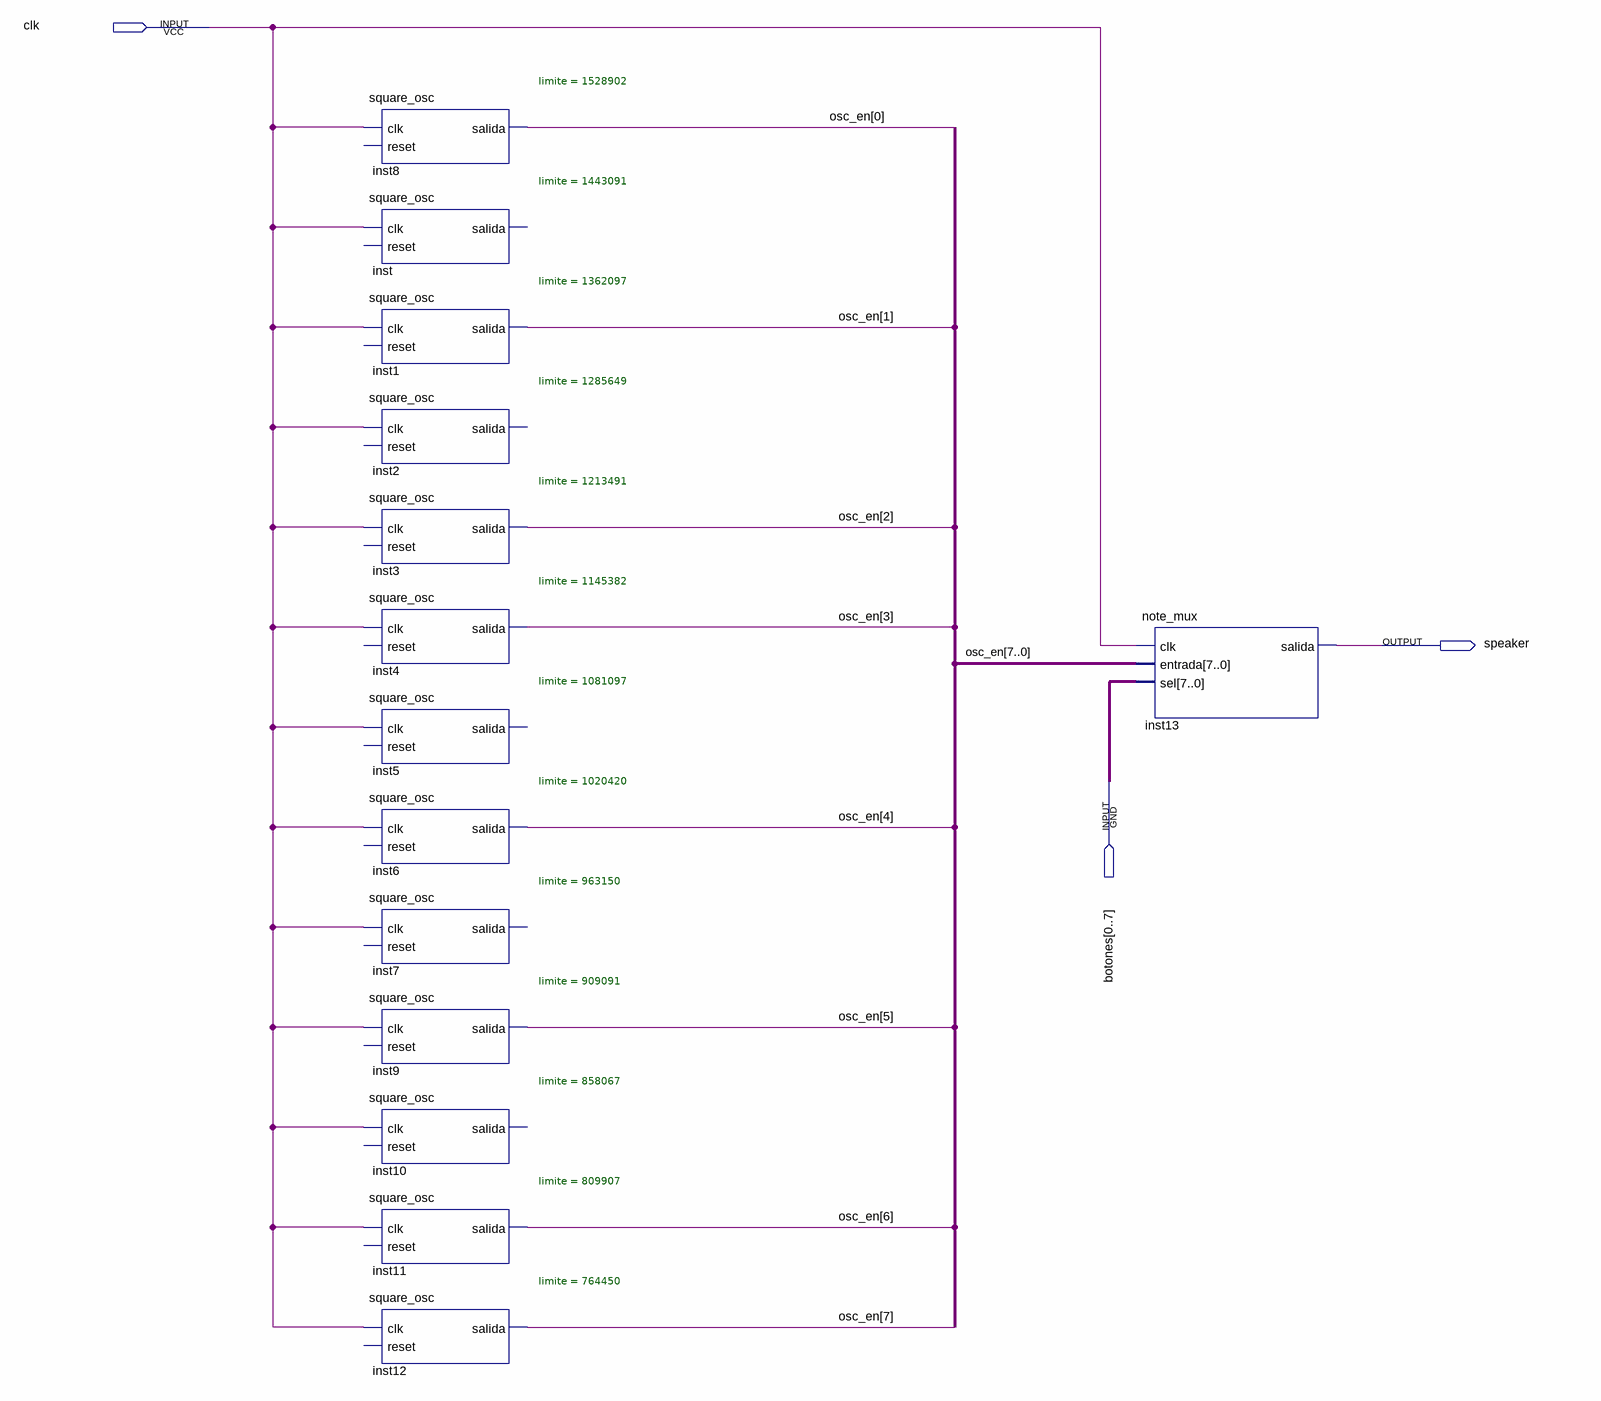
[diagram p0: schematic sheet]
// Quartus schematic synth_top.bdf as structural Verilog: 14 symbols, 3 pins
module synth_top (
  input  clk,
  input  [0:7] botones,
  output speaker
);

  wire [7:0] osc_en;

  square_osc #(.limite(1528902)) inst8 (.clk(clk), .salida(osc_en[0]));  // open: reset
  square_osc #(.limite(1443091)) inst (.clk(clk));  // open: reset, salida
  square_osc #(.limite(1362097)) inst1 (.clk(clk), .salida(osc_en[1]));  // open: reset
  square_osc #(.limite(1285649)) inst2 (.clk(clk));  // open: reset, salida
  square_osc #(.limite(1213491)) inst3 (.clk(clk), .salida(osc_en[2]));  // open: reset
  square_osc #(.limite(1145382)) inst4 (.clk(clk), .salida(osc_en[3]));  // open: reset
  square_osc #(.limite(1081097)) inst5 (.clk(clk));  // open: reset, salida
  square_osc #(.limite(1020420)) inst6 (.clk(clk), .salida(osc_en[4]));  // open: reset
  square_osc #(.limite(963150)) inst7 (.clk(clk));  // open: reset, salida
  square_osc #(.limite(909091)) inst9 (.clk(clk), .salida(osc_en[5]));  // open: reset
  square_osc #(.limite(858067)) inst10 (.clk(clk));  // open: reset, salida
  square_osc #(.limite(809907)) inst11 (.clk(clk), .salida(osc_en[6]));  // open: reset
  square_osc #(.limite(764450)) inst12 (.clk(clk), .salida(osc_en[7]));  // open: reset
  note_mux inst13 (.clk(clk), .entrada(osc_en), .sel(botones), .salida(speaker));
endmodule
